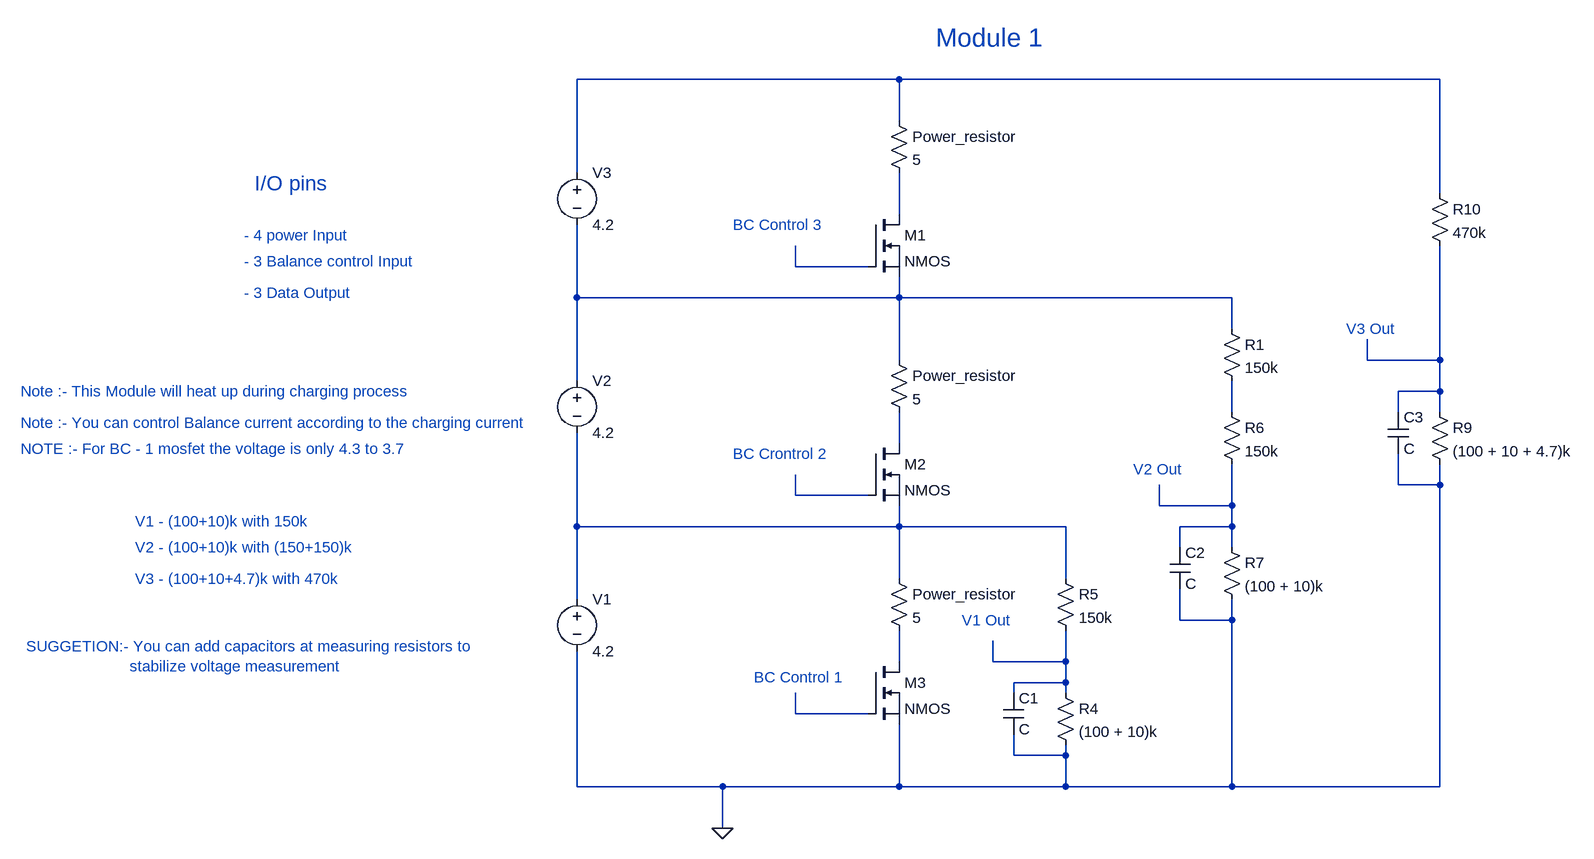
[diagram p0: schematic Module 1.asc]
Module 1.asc, the LTspice schematic file:
Version 4
SHEET 1 1728 1028
WIRE 656 -144 160 -144
WIRE 1488 -144 656 -144
WIRE 656 -80 656 -144
WIRE 160 0 160 -144
WIRE 1488 32 1488 -144
WIRE 656 64 656 0
WIRE 496 144 496 112
WIRE 608 144 496 144
WIRE 160 192 160 80
WIRE 656 192 656 160
WIRE 656 192 160 192
WIRE 1168 192 656 192
WIRE 1168 240 1168 192
WIRE 656 288 656 192
WIRE 1376 288 1376 256
WIRE 1488 288 1488 112
WIRE 1488 288 1376 288
WIRE 160 320 160 192
WIRE 1488 336 1488 288
WIRE 1488 336 1424 336
WIRE 1168 368 1168 320
WIRE 1424 368 1424 336
WIRE 1488 368 1488 336
WIRE 656 416 656 368
WIRE 1424 480 1424 432
WIRE 1488 480 1488 448
WIRE 1488 480 1424 480
WIRE 496 496 496 464
WIRE 608 496 496 496
WIRE 1056 512 1056 480
WIRE 1168 512 1168 448
WIRE 1168 512 1056 512
WIRE 160 544 160 400
WIRE 656 544 656 512
WIRE 656 544 160 544
WIRE 912 544 656 544
WIRE 1168 544 1168 512
WIRE 1168 544 1088 544
WIRE 1088 576 1088 544
WIRE 1168 576 1168 544
WIRE 656 624 656 544
WIRE 912 624 912 544
WIRE 160 656 160 544
WIRE 1088 688 1088 640
WIRE 1168 688 1168 656
WIRE 1168 688 1088 688
WIRE 656 752 656 704
WIRE 800 752 800 720
WIRE 912 752 912 704
WIRE 912 752 800 752
WIRE 912 784 912 752
WIRE 912 784 832 784
WIRE 832 800 832 784
WIRE 912 800 912 784
WIRE 496 832 496 800
WIRE 608 832 496 832
WIRE 832 896 832 864
WIRE 912 896 912 880
WIRE 912 896 832 896
WIRE 160 944 160 736
WIRE 384 944 160 944
WIRE 656 944 656 848
WIRE 656 944 384 944
WIRE 912 944 912 896
WIRE 912 944 656 944
WIRE 1168 944 1168 688
WIRE 1168 944 912 944
WIRE 1488 944 1488 480
WIRE 1488 944 1168 944
WIRE 384 1008 384 944
FLAG 384 1008 0
SYMBOL voltage 160 -16 R0
WINDOW 123 0 0 Left 0
WINDOW 39 0 0 Left 0
SYMATTR InstName V3
SYMATTR Value 4.2
SYMBOL voltage 160 304 R0
WINDOW 123 0 0 Left 0
WINDOW 39 0 0 Left 0
SYMATTR InstName V2
SYMATTR Value 4.2
SYMBOL voltage 160 640 R0
WINDOW 123 0 0 Left 0
WINDOW 39 0 0 Left 0
SYMATTR InstName V1
SYMATTR Value 4.2
SYMBOL nmos 608 64 R0
SYMATTR InstName M1
SYMBOL nmos 608 416 R0
SYMATTR InstName M2
SYMBOL nmos 608 752 R0
SYMATTR InstName M3
SYMBOL res 640 -96 R0
SYMATTR InstName Power_resistor
SYMATTR Value 5
SYMBOL res 640 272 R0
SYMATTR InstName Power_resistor
SYMATTR Value 5
SYMBOL res 640 608 R0
SYMATTR InstName Power_resistor
SYMATTR Value 5
SYMBOL res 896 784 R0
SYMATTR InstName R4
SYMATTR Value (100 + 10)k
SYMBOL res 896 608 R0
SYMATTR InstName R5
SYMATTR Value 150k
SYMBOL res 1152 352 R0
SYMATTR InstName R6
SYMATTR Value 150k
SYMBOL res 1152 560 R0
SYMATTR InstName R7
SYMATTR Value (100 + 10)k
SYMBOL res 1472 352 R0
SYMATTR InstName R9
SYMATTR Value (100 + 10 + 4.7)k
SYMBOL res 1472 16 R0
SYMATTR InstName R10
SYMATTR Value 470k
SYMBOL res 1152 224 R0
SYMATTR InstName R1
SYMATTR Value 150k
SYMBOL cap 816 800 R0
SYMATTR InstName C1
SYMBOL cap 1072 576 R0
SYMATTR InstName C2
SYMBOL cap 1408 368 R0
SYMATTR InstName C3
TEXT 432 776 Left 2 ;BC Control 1
TEXT 400 432 Left 2 ;BC Crontrol 2
TEXT 400 80 Left 2 ;BC Control 3
TEXT 752 688 Left 2 ;V1 Out
TEXT 1016 456 Left 2 ;V2 Out
TEXT 1344 240 Left 2 ;V3 Out
TEXT 712 -208 Left 4 ;Module 1
TEXT -336 16 Left 3 ;I/O pins
TEXT -352 96 Left 2 ;- 4 power Input
TEXT -352 136 Left 2 ;- 3 Balance control Input
TEXT -352 184 Left 2 ;- 3 Data Output
TEXT -696 336 Left 2 ;Note :- This Module will heat up during charging process
TEXT -696 384 Left 2 ;Note :- You can control Balance current according to the charging current
TEXT -696 424 Left 2 ;NOTE :- For BC - 1 mosfet the voltage is only 4.3 to 3.7
TEXT -520 536 Left 2 ;V1 - (100+10)k with 150k
TEXT -520 576 Left 2 ;V2 - (100+10)k with (150+150)k
TEXT -520 624 Left 2 ;V3 - (100+10+4.7)k with 470k
TEXT -688 728 Left 2 ;SUGGETION:- You can add capacitors at measuring resistors to \n                       stabilize voltage measurement

The netlist it stands for:
* Module 1.asc
V3 N001 N004 4.2
V2 N004 N010 4.2
V1 N010 0 4.2
M1 N002 N003 N004 N004 NMOS
M2 N007 N008 N010 N010 NMOS
M3 N011 N013 0 0 NMOS
R§Power_resistor N001 N002 5
R§Power_resistor N004 N007 5
R§Power_resistor N010 N011 5
R4 N012 0 (100 + 10)k
R5 N010 N012 150k
R6 N006 N009 150k
R7 N009 0 (100 + 10)k
R9 N005 0 (100 + 10 + 4.7)k
R10 N001 N005 470k
R1 N004 N006 150k
C1 N012 0 C
C2 N009 0 C
C3 N005 0 C
.model NMOS NMOS
.model PMOS PMOS
.lib standard.mos
* BC Control 1
* BC Crontrol 2
* BC Control 3
* V1 Out
* V2 Out
* V3 Out
* Module 1
* I/O pins
* - 4 power Input
* - 3 Balance control Input
* - 3 Data Output
* Note :- This Module will heat up during charging process
* Note :- You can control Balance current according to the charging current
* NOTE :- For BC - 1 mosfet the voltage is only 4.3 to 3.7
* V1 - (100+10)k with 150k
* V2 - (100+10)k with (150+150)k
* V3 - (100+10+4.7)k with 470k
* SUGGETION:- You can add capacitors at measuring resistors to
*                        stabilize voltage measurement
.backanno
.end